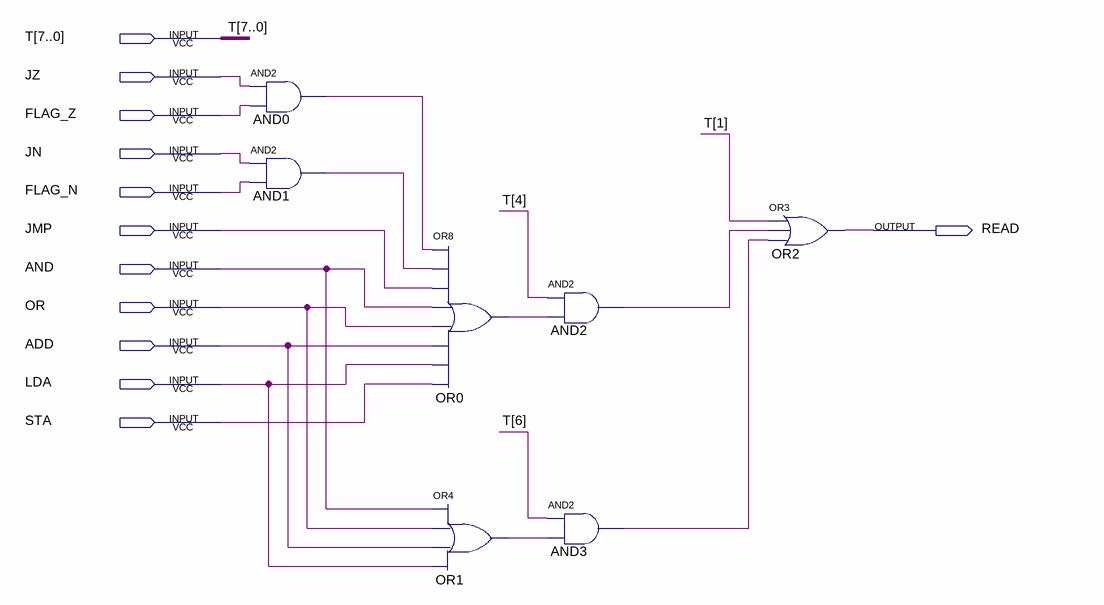
[diagram p0: schematic sheet]
// Quartus schematic READ.bdf as structural Verilog: 7 symbols, 12 pins
module READ (
  input  [7:0] T,
  input  JZ,
  input  FLAG_Z,
  input  JN,
  input  FLAG_N,
  input  JMP,
  input  AND,
  input  OR,
  input  ADD,
  input  LDA,
  input  STA,
  output READ
);

  wire AND0_out, AND1_out, AND2_out, AND3_out, OR0_out, OR1_out;

  and AND0 (AND0_out, JZ, FLAG_Z);
  and AND1 (AND1_out, JN, FLAG_N);
  or OR0 (OR0_out, AND0_out, AND1_out, JMP, AND, OR, ADD, LDA, STA);
  or OR1 (OR1_out, AND, OR, ADD, LDA);
  and AND2 (AND2_out, T[4], OR0_out);
  and AND3 (AND3_out, T[6], OR1_out);
  or OR2 (READ, T[1], AND2_out, AND3_out);
endmodule
